# EAGLE design fiddle.old (EAGLE 7.3.0)
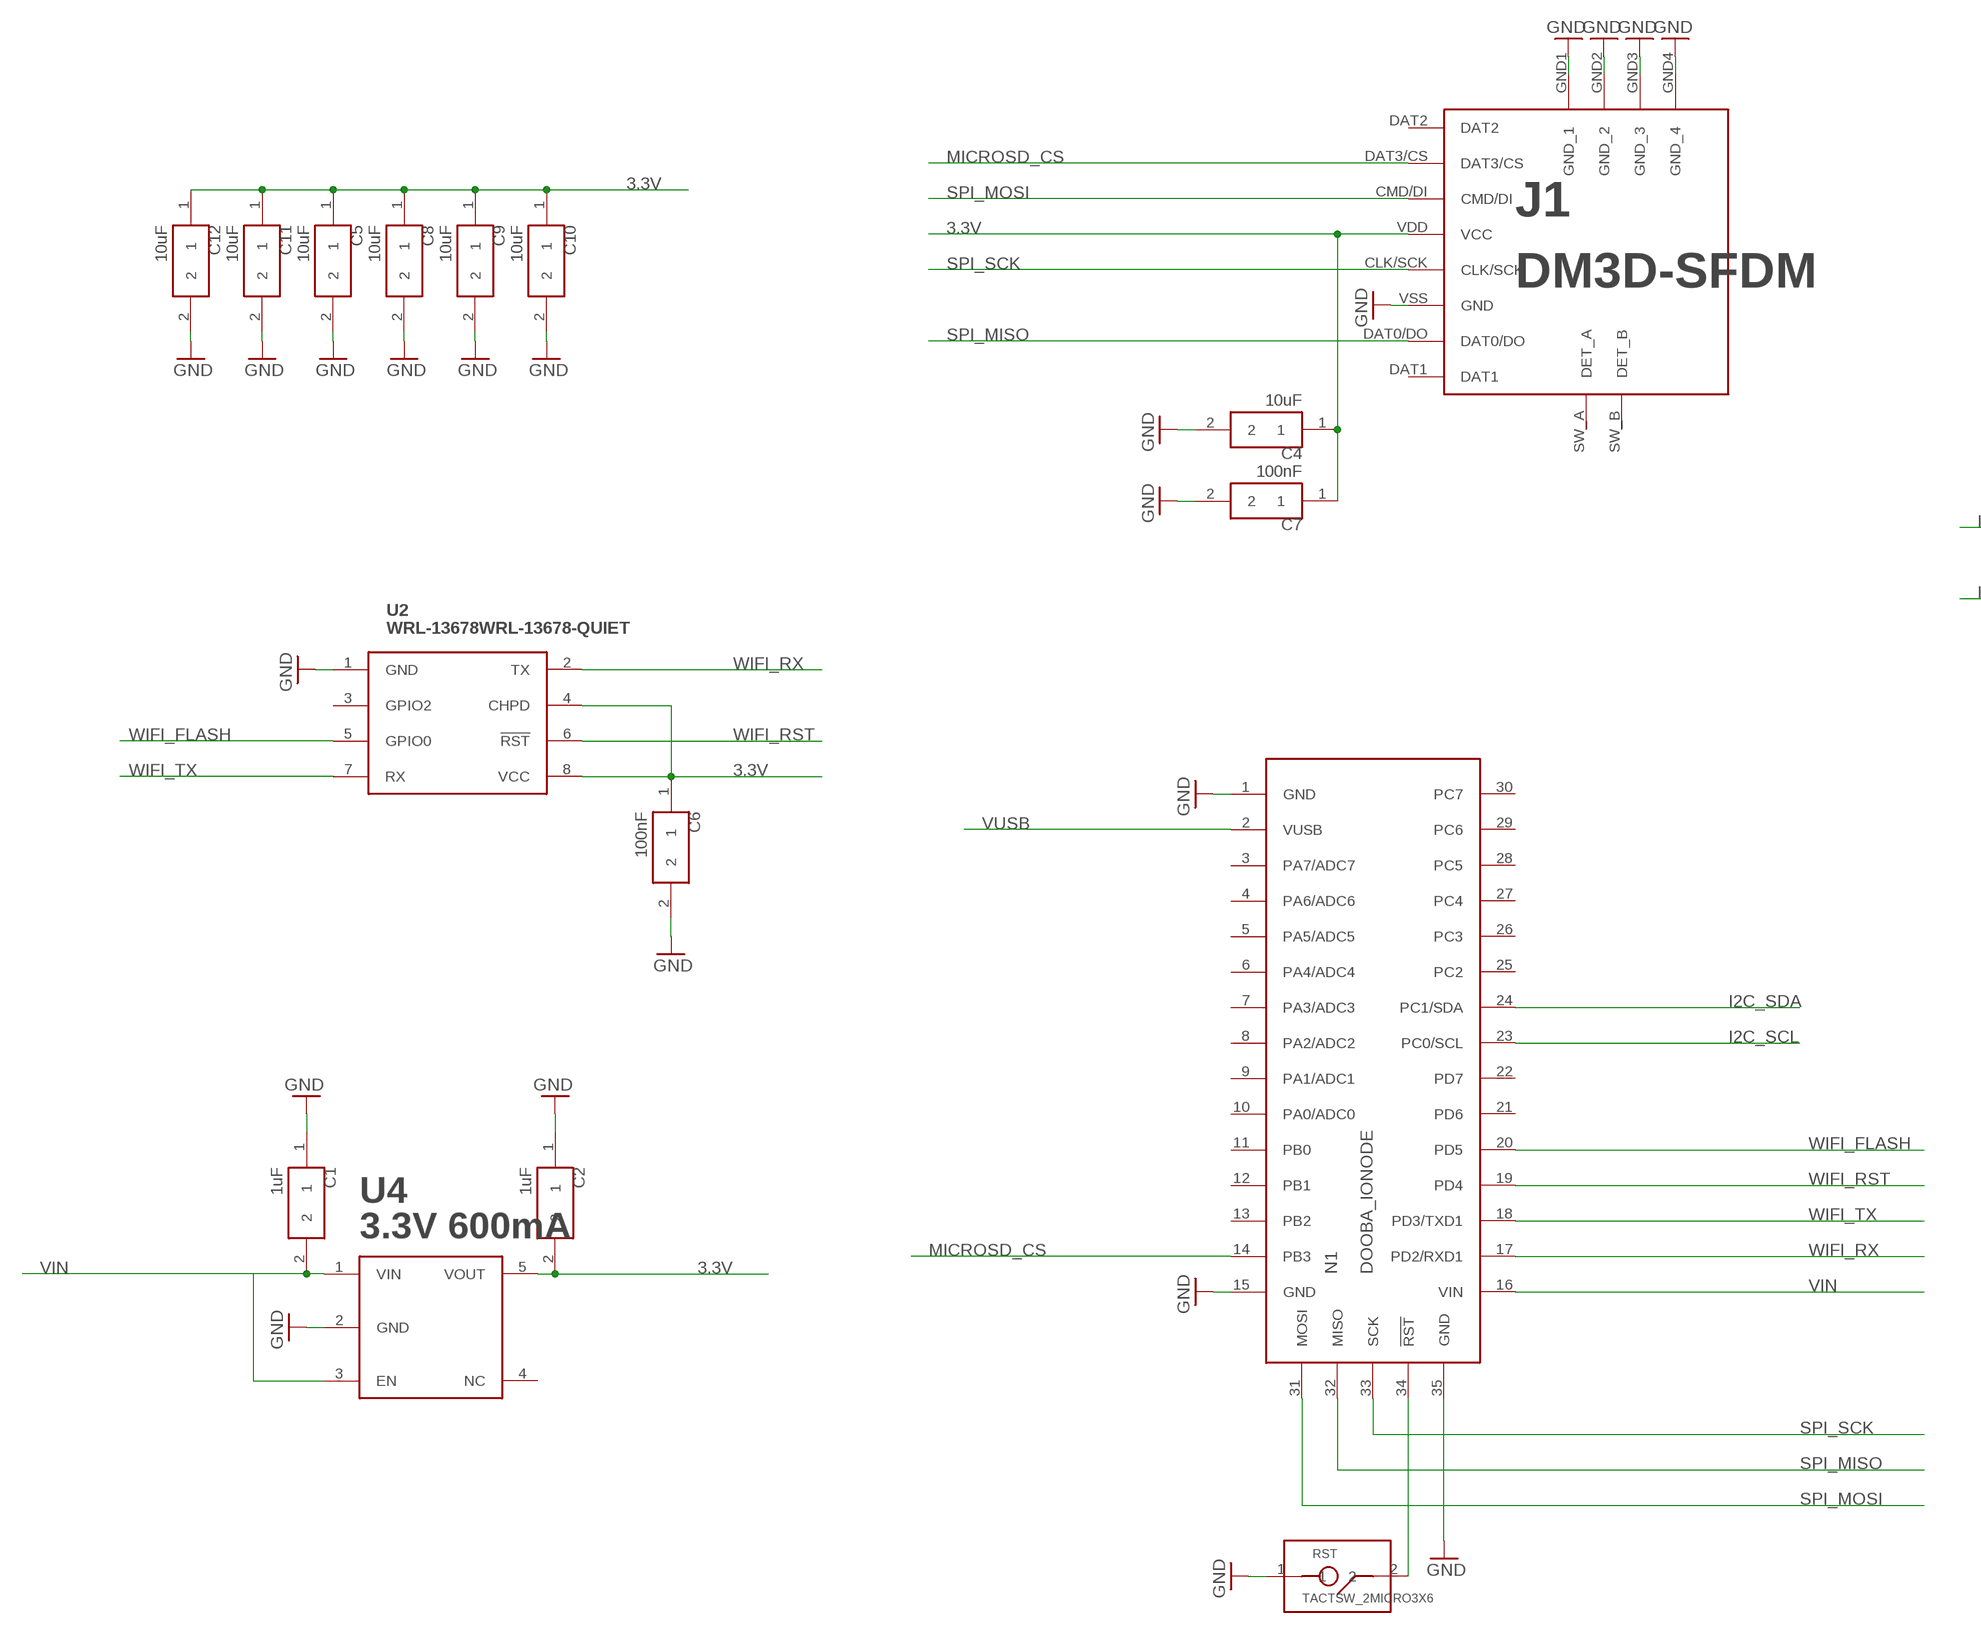
[diagram p0: schematic, sheet 1, part 1 of 2]
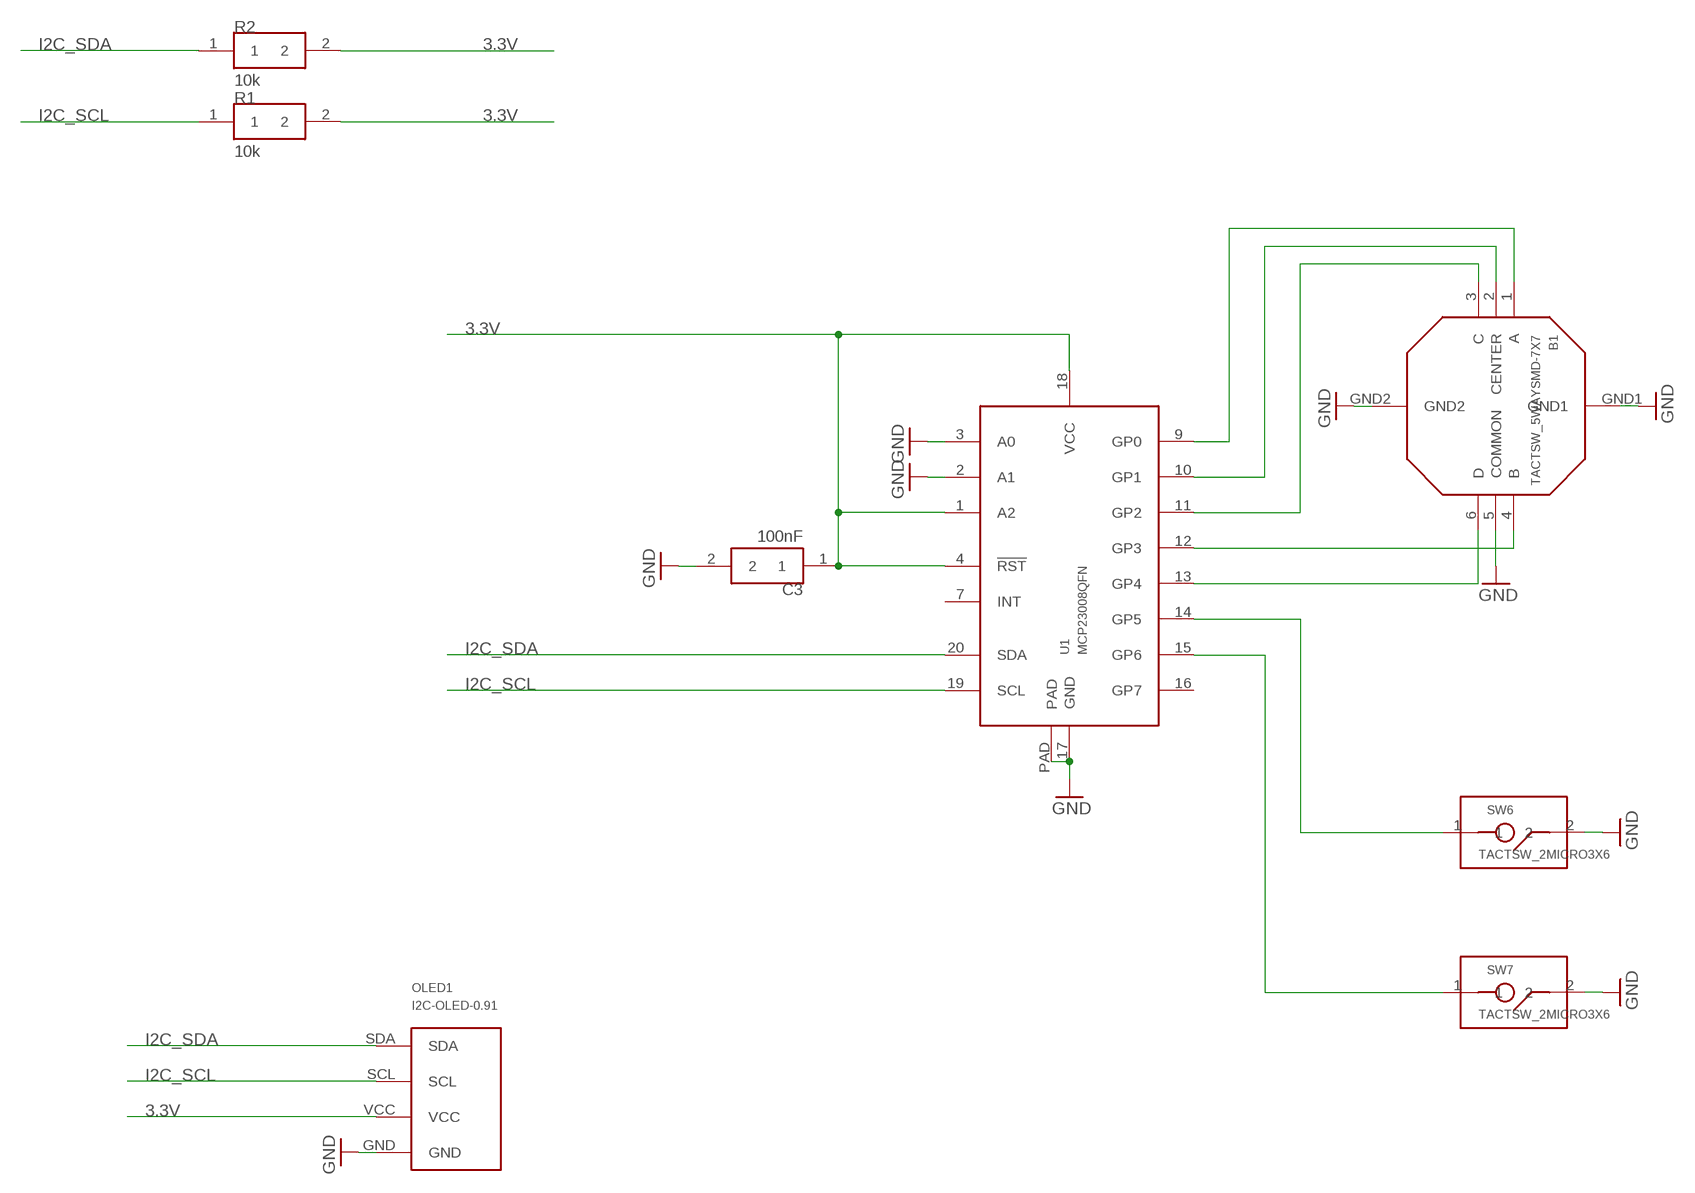
[diagram p1: schematic, sheet 1, part 2 of 2]

## Parts
B1  TACTSW_5WAYSMD-7X7  [TACTSW-5WAY-7X7]
C1  1uF  CAP0805  [0805]
C2  1uF  CAP0805  [0805]
C3  100nF  CAP0805  [0805]
C4  10uF  CAP0805  [0805]
C5  10uF  CAP0805  [0805]
C6  100nF  CAP0805  [0805]
C7  100nF  CAP0805  [0805]
C8  10uF  CAP0805  [0805]
C9  10uF  CAP0805  [0805]
C10  10uF  CAP0805  [0805]
C11  10uF  CAP0805  [0805]
C12  10uF  CAP0805  [0805]
J1  DM3D-SFDM  [DM3D-SF]
N1  DOOBA_IONODE  [DOOBA_IONODE]
OLED1  I2C-OLED-0.91  [I2C-OLED-0.91]
R1  10k  RES0805  [0805]
R2  10k  RES0805  [0805]
RST  TACTSW_2MICRO3X6  [TACTSW_MICRO3X6]
SW6  TACTSW_2MICRO3X6  [TACTSW_MICRO3X6]
SW7  TACTSW_2MICRO3X6  [TACTSW_MICRO3X6]
U1  MCP23008QFN  [20-VQFN]
U2  WRL-13678WRL-13678-QUIET  [WRL-13678-QUIET]
U4  3.3V 600mA  LP3985SOT23-5  [SOT23-5]

## Nets
3.3V: C2.2 C3.1 C4.1 C5.1 C6.1 C7.1 C8.1 C9.1 C10.1 C11.1 C12.1 J1.VDD(VCC) OLED1.VCC R1.2 R2.2 U1.1(A2) U1.4(!RST) U1.18(VCC) U2.4(CHPD) U2.8(VCC) U4.5(VOUT)
GND: B1.5(COMMON) B1.GND1 B1.GND2 C1.1 C2.1 C3.2 C4.2 C5.2 C6.2 C7.2 C8.2 C9.2 C10.2 C11.2 C12.2 J1.GND1(GND_1) J1.GND2(GND_2) J1.GND3(GND_3) J1.GND4(GND_4) J1.VSS(GND) N1.1(GND) N1.15(GND) N1.35(GND) OLED1.GND RST.1 SW6.2 SW7.2 U1.2(A1) U1.3(A0) U1.17(GND) U1.PAD U2.1(GND) U4.2(GND)
I2C_SCL: N1.23(PC0/SCL) OLED1.SCL R1.1 U1.19(SCL)
I2C_SDA: N1.24(PC1/SDA) OLED1.SDA R2.1 U1.20(SDA)
MICROSD_CS: J1.DAT3/CS N1.14(PB3)
N$1: B1.1(A) U1.9(GP0)
N$2: B1.2(CENTER) U1.10(GP1)
N$3: B1.3(C) U1.11(GP2)
N$4: B1.6(D) U1.13(GP4)
N$5: B1.4(B) U1.12(GP3)
N$6: SW6.1 U1.14(GP5)
N$7: SW7.1 U1.15(GP6)
N$8: N1.34(!RST) RST.2
SPI_MISO: J1.DAT0/DO N1.32(MISO)
SPI_MOSI: J1.CMD/DI N1.31(MOSI)
SPI_SCK: J1.CLK/SCK N1.33(SCK)
VIN: C1.2 N1.16(VIN) U4.1(VIN) U4.3(EN)
VUSB: N1.2(VUSB)
WIFI_FLASH: N1.20(PD5) U2.5(GPIO0)
WIFI_RST: N1.19(PD4) U2.6(!RST)
WIFI_RX: N1.17(PD2/RXD1) U2.2(TX)
WIFI_TX: N1.18(PD3/TXD1) U2.7(RX)
Unconnected: J1.DAT1 J1.DAT2 J1.SW_A(DET_A) J1.SW_B(DET_B) N1.3(PA7/ADC7) N1.4(PA6/ADC6) N1.5(PA5/ADC5) N1.6(PA4/ADC4) N1.7(PA3/ADC3) N1.8(PA2/ADC2) N1.9(PA1/ADC1) N1.10(PA0/ADC0) N1.11(PB0) N1.12(PB1) N1.13(PB2) N1.21(PD6) N1.22(PD7) N1.25(PC2) N1.26(PC3) N1.27(PC4) N1.28(PC5) N1.29(PC6) N1.30(PC7) U1.7(INT) U1.16(GP7) U2.3(GPIO2) U4.4(NC)

## Library data of the parts
B1 = dooba:TACTSW_5WAY
C1-C12 = dooba:CAP
J1 = dooba:DM3D-SF
N1 = dooba:DOOBA_IONODE
OLED1 = dooba:I2C-OLED-0.91
R1 R2 = dooba:RES
RST SW6 SW7 = dooba:TACTSW_2
U1 = dooba:MCP23008
U2 = dooba:WRL-13678
U4 = dooba:LP3985

## Board
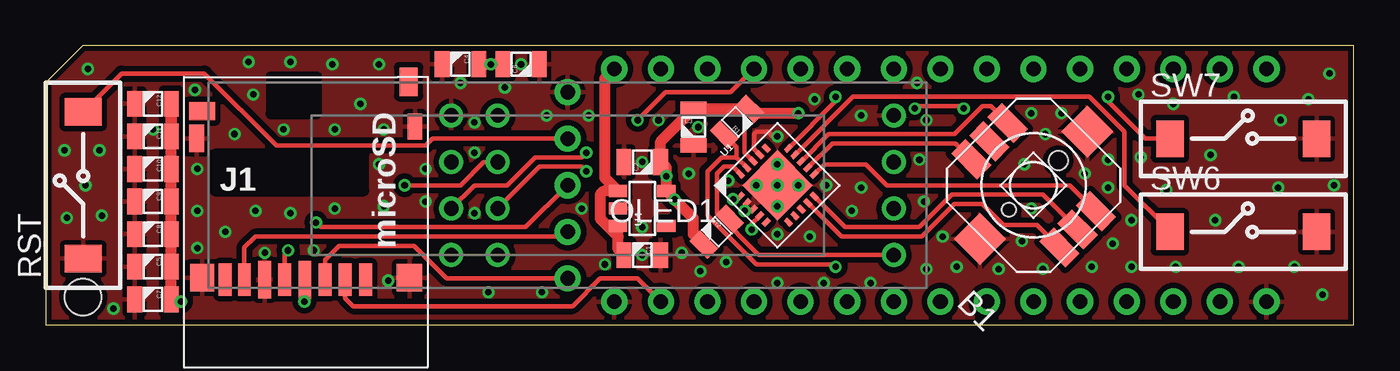
[diagram p2: board, top side]
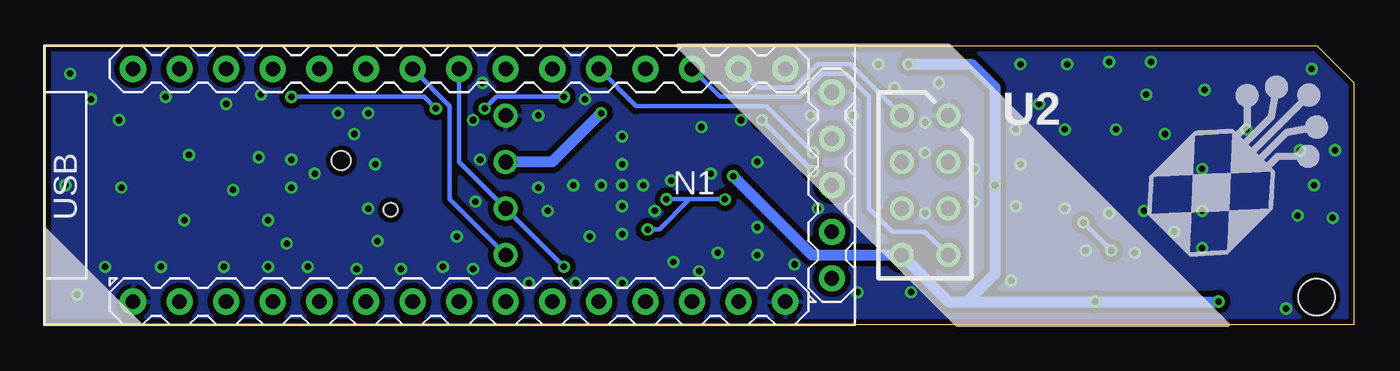
[diagram p3: board, bottom side, seen from below]

Size 71.3 x 15.23 mm. Coordinates in mm from the lower left corner, seen from the top.
Outline: 0,0 71.3,0 71.3,15.23 2.02,15.23 0,13.21 0,0
Copper layers (1*16): Top 0.035mm / dielectric 1.5mm / Bottom 0.035mm
Design rules "dooba": minimum track width 6mil, minimum drill 12mil, track to track 6mil, track to pad 6mil, pad to pad 6mil, via to via 6mil, smd to smd 0mil, copper to edge 10mil, drill to drill 10mil, minimum pad ring 10mil, minimum via ring 6mil, stop-mask expansion 2mil, vias tented up to drill 25mil, thermal gap 10mil
Holes 2 mm at 2.03,1.52

### Footprints (pad centres in the part's own frame; a part is rotated, then mirrored left to right if it is on the bottom)
TACTSW-5WAY-7X7 = smd 2 x 1.1: 1 -3.4,1.4; 2 -3.4,0; 3 -3.4,-1.4; 4 3.4,1.4; 5 3.4,0; 6 3.4,-1.4 | smd 2 x 2: GND1 0,4.15; GND2 0,-4.15 | hole 0.75: 0,1.9 | hole 1.05: 0,-1.9
0805 = smd 0.8 x 1.4: 1 -1,0; 2 1,0
DM3D-SF = smd 0.7 x 1.75: CLK/SCK -1.2,-1.34; CMD/DI 1,-1.34; DAT0/DO -3.4,-1.34; DAT1 -4.45,-1.34; DAT2 3.2,-1.34; DAT3/CS 2.1,-1.34 | smd 0.8 x 1.5: GND1 -6,6.36 | smd 0.8 x 1.4: GND2 5.9,7.01 | smd 1.4 x 1.5: GND3 5.6,-1.24 | smd 1.3 x 1.5: GND4 -5.7,-1.24 | smd 1 x 1.55: SW_A 5.55,9.46 | smd 1.4 x 1: SW_B -5.7,7.86 | smd 0.7 x 2.032: VDD -0.1,-1.34; VSS -2.3,-1.34
DOOBA_IONODE = drill 0.8 pad 1.422: 1 16.51,6.35; 2 13.97,6.35; 3 11.43,6.35; 4 8.89,6.35; 5 6.35,6.35; 6 3.81,6.35; 7 1.27,6.35; 8 -1.27,6.35; 9 -3.81,6.35; 10 -6.35,6.35; 11 -8.89,6.35; 12 -11.43,6.35; 13 -13.97,6.35; 14 -16.51,6.35; 15 -19.05,6.35; 16 -19.05,-6.35; 17 -16.51,-6.35; 18 -13.97,-6.35; 19 -11.43,-6.35; 20 -8.89,-6.35; 21 -6.35,-6.35; 22 -3.81,-6.35; 23 -1.27,-6.35; 24 1.27,-6.35; 25 3.81,-6.35; 26 6.35,-6.35; 27 8.89,-6.35; 28 11.43,-6.35; 29 13.97,-6.35; 30 16.51,-6.35; 31 -21.59,5.08; 32 -21.59,2.54; 33 -21.59,0; 34 -21.59,-2.54; 35 -21.59,-5.08
I2C-OLED-0.91 = drill 0.8: GND -17.78,-3.81; SCL -17.78,1.27; SDA -17.78,3.81; VCC -17.78,-1.27
TACTSW_MICRO3X6 = smd 1.5 x 2: 1 -4,0; 2 4,0
20-VQFN = smd 0.45 x 0.26: 1 -1.85,1; 2 -1.85,0.5; 3 -1.85,0; 4 -1.85,-0.5; 5 -1.85,-1; 11 1.85,-1; 12 1.85,-0.5; 13 1.85,0; 14 1.85,0.5; 15 1.85,1 | smd 0.26 x 0.45: 6 -1,-1.85; 7 -0.5,-1.85; 8 0,-1.85; 9 0.5,-1.85; 10 1,-1.85; 16 1,1.85; 17 0.5,1.85; 18 0,1.85; 19 -0.5,1.85; 20 -1,1.85 | smd 2.7 x 2.7: PAD 0,0
WRL-13678-QUIET = drill 0.8: 1 -8.89,3.81; 2 -11.43,3.81; 3 -8.89,1.27; 4 -11.43,1.27; 5 -8.89,-1.27; 6 -11.43,-1.27; 7 -8.89,-3.81; 8 -11.43,-3.81
SOT23-5 = smd 0.66 x 1: 1 0.95,1.315; 2 0,1.315; 3 -0.95,1.315; 4 -0.95,-1.315; 5 0.95,-1.315

### Placement (x,y rotation side)
B1  53.85,7.62 135 top
C1  32.51,3.81 180 top
C2  32.51,8.89 0 top
C3  35.31,10.79 270 top
C4  22.61,14.22 180 top
C5  5.84,3.17 180 top
C6  25.91,14.22 0 top
C7  5.84,1.4 180 top
C8  5.84,4.95 180 top
C9  5.84,6.73 180 top
C10  5.84,8.51 180 top
C11  5.84,10.29 180 top
C12  5.84,12.06 180 top
J1  14.22,3.81 0 top
N1  50.04,7.62 180 bottom
OLED1  28.45,7.62 180 top
R1  37.68,11.09 45 top
R2  36.58,5.08 225 top
RST  2.03,7.62 90 top
SW6  65.28,5.08 0 top
SW7  65.28,10.16 0 top
U1  39.88,7.62 45 top
U2  13.21,7.62 0 bottom
U4  32.51,6.35 90 top

### Tracks (layer width: path | path; a pad name or v marks a point on that pad's centre or on a via)
3.3V  (via drill 0.36)
  Top 0.254: U1.18 38.1,9.4 38.1,11.5 R1.2 | U1.1 37.7,6.86 v37.47,6.86 | U1.4 38.48,5.52 v38.48,5.21 | U2.4 23.88,8.89 22.61,7.62 v19.56,7.62
  Top 0.61: R2.2 35.87,4.39 35.31,4.95 35.31,5.82 v34.28,6.85 U4.5 v33.83,8.12 33.83,8.57 C2.2 33.51,10 C3.1 R1.2 38.72,11.54 38.73,11.56 v41.02,11.56 | v7.37,1.27 C7.1 C5.1 C8.1 C9.1 C10.1 C11.1 C12.1 6.84,10.3 6.86,10.29 | J1.VDD 14.12,1.3 v14.1,1.27 | C4.1 v24.26,14.22 C6.1
  Bottom 0.254: v34.28,6.85 34.29,6.86 36.2,6.86 | 36.2,6.86 v37.47,6.86 | v38.48,5.21 37.85,5.21 36.2,6.86
  Bottom 0.61: v41.02,11.56 43.69,8.89 OLED1.VCC | v33.83,8.12 29.52,3.81 U2.8 22.1,1.27 21.08,1.27 | 21.08,1.27 v14.1,1.27 v7.37,1.27 | v24.26,14.22 20.83,14.22 19.56,12.95 v19.56,7.62 19.56,2.79 21.08,1.27
GND  (via drill 0.36)
  Top 0.254: U1.3 38.48,6.22 v38.1,6.22 | U1.17 38.61,9.6 38.61,10.41 38.73,10.54 39.37,10.54 39.62,10.29 v39.88,10.29
  Bottom 0.254: v38.1,6.22 37.97,6.1
  other vias: 39.88,6.48 41.02,7.62 39.88,8.76 38.73,7.62 39.88,7.62 37.21,7.87 39.88,4.95 42.55,7.62 41.66,4.83 44.45,7.49 43.94,6.22 37.08,3.43 34.67,3.94 35.69,2.92 32.51,3.81 35.05,8.25 32.51,8.89 41.91,12.32 44.45,11.43 47.62,9.02 47.88,6.73 48.9,4.83 48.01,3.05 44.96,2.29 42.42,2.29 39.88,2.29 53.21,4.57 51.94,3.05 54.36,3.05 57.02,3.17 53.72,6.35 53.34,8.76 54.48,10.41 56.64,8.25 57.91,9.02 55.37,11.56 53.72,11.56 57.91,7.49 59.18,5.71 58.17,4.45 59.18,3.17 59.69,9.14 61.09,7.37 61.59,3.17 65.02,3.17 63.75,5.71 67.18,7.49 63.5,9.27 68.07,3.17 67.31,11.18 61.47,12.06 70.23,7.62 69.6,1.65 68.83,12.32 69.98,13.72 48.01,11.18 47.5,13.21 59.56,12.57 64.77,12.45 49.66,3.17 11.94,3.94 18.67,2.41 20.7,6.73 18.42,6.48 18.16,8.76 20.7,8.51 29.21,6.35 23.37,6.1 23.37,9.4 24.13,1.78 27.05,1.78 30.48,3.3 29.59,11.43 27.31,11.43 33.4,11.18 35.56,10.79 32.51,5.33 25.91,14.22 22.61,13.21 25.02,12.95 23.37,11.05 15.75,6.35 13.34,6.1 12.95,10.67 15.75,10.67 18.42,10.67 17.14,12.06 15.62,14.22 18.16,14.22 11.3,12.57 11.05,14.35 13.34,14.35 2.29,13.97 5.84,10.67 8.26,4.19 8.26,8.51 8.26,6.22 9.78,5.08 11.43,6.22 10.29,10.41 2.92,9.52 3.05,5.97 2.16,7.62 1.02,9.52 1.14,5.84 3.68,0.89 14.61,4.06 8.13,12.83
  pour Bottom (isolate 0.305): 0,0 0,13.21 2.03,15.24 71.63,15.24 71.63,0
  pour Top (isolate 0.305): 0,0 0,13.21 2.03,15.24 71.63,15.24 71.63,0
I2C_SCL  (via drill 0.36)
  Top 0.254: 37.65,9.14 36.83,9.14 36.07,8.38 36.07,5.97 38.73,3.3 42.93,3.3 v43.05,3.17 | 37.65,9.14 U1.19 | 37.65,9.14 37.65,9.71 R1.1
  Bottom 0.254: v43.05,3.17 OLED1.SCL 48.77,8.89 N1.23
I2C_SDA
  Top 0.254: OLED1.SDA 38.86,3.81 36.58,6.1 | 36.58,6.1 36.58,8.25 36.96,8.64 37.45,8.64 U1.20 | 36.58,6.1 36.97,6.1 R2.1
  Bottom 0.254: N1.24 49.28,11.94 49.28,6.86 OLED1.SDA
MICROSD_CS
  Top 0.254: J1.DAT3/CS 16.32,1.46 16.76,1.02 28.7,1.02 30.23,2.54 32.26,2.54 N1.14
N$1
  Top 0.254: U1.9 43.38,4.83 47.75,4.83 49.53,6.6 51.05,6.6 52.2,5.46 54.03,5.46 B1.1
N$2
  Top 0.254: B1.2 54.36,7.11 49.4,7.11 47.62,5.33 43.58,5.33 U1.10
N$3
  Top 0.254: U1.11 42.44,8.76 44.7,8.76 45.85,7.62 55.83,7.62 B1.3
N$4
  Top 0.254: B1.6 51.51,11.94 51.05,11.94 49.53,10.41 42.67,10.41 U1.13
N$5
  Top 0.254: B1.4 49.58,9.91 42.87,9.91 U1.12
N$6
  Top 0.254: U1.14 44,12.45 56.9,12.45 58.8,10.54 58.8,7.62 61.28,5.14 SW6.1
N$7  (via drill 0.36)
  Top 0.254: U1.15 43.05,12.21 v43.05,12.45 | v57.91,12.45 57.91,12.19 59.94,10.16 SW7.1 | v47.37,11.81 47.5,11.94 49.91,11.94 v50.04,11.81
  Bottom 0.254: v43.05,12.45 46.74,12.45 v47.37,11.81 | v50.04,11.81 50.67,12.45 v57.91,12.45
N$8
  Top 0.254: RST.2 4.13,13.72 8.64,13.72 12.57,9.78 20.7,9.78 21.08,10.16 N1.34
SPI_MISO
  Top 0.254: J1.DAT0/DO 10.82,4.22 11.43,4.83 28.19,4.83 N1.32
SPI_MOSI
  Top 0.254: N1.31 21.84,2.54 20.07,4.32 16,4.32 15.22,3.54 J1.CMD/DI
SPI_SCK  (via drill 0.36)
  Top 0.254: v13.21,4.06 13.02,3.88 J1.CLK/SCK | N1.33 26.16,5.33 14.99,5.33 v14.73,5.59
  Bottom 0.254: v14.73,5.59 v13.21,4.06
VIN
  Top 0.61: C1.2 31.2,4.12 31.2,4.83 | 31.2,4.83 U4.3 | 31.2,4.83 30.23,5.8 30.23,7.11 30.41,7.3 U4.1 30.48,8.02 30.48,13.46 N1.16
WIFI_FLASH  (via drill 0.36)
  Top 0.254: U2.5 23.37,7.62 25.15,7.62 26.67,9.14 29.21,9.14 v29.46,9.4
  Bottom 0.254: v29.46,9.4 32,11.94 39.12,11.94 N1.20
WIFI_RST  (via drill 0.36)
  Top 0.254: U2.6 26.92,8.64 29.21,8.64 v29.46,8.38 | v32.26,11.18 33.78,12.7 37.34,12.7 N1.19
  Bottom 0.254: v29.46,8.38 v32.26,11.18
WIFI_RX
  Bottom 0.254: N1.17 32.51,12.95 30.48,12.95 29.21,14.22 27.43,14.22 U2.2
WIFI_TX
  Bottom 0.254: N1.18 34.54,12.45 30.23,12.45 28.96,13.72 27.69,13.72 26.42,12.45 26.42,6.35 25.15,5.08 23.37,5.08 U2.7